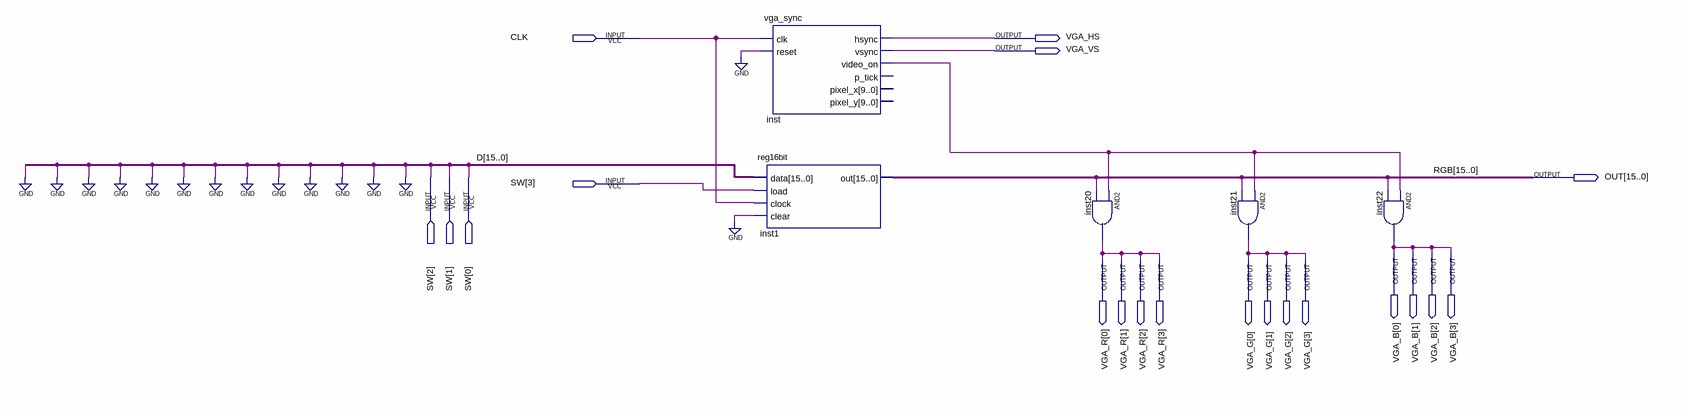
[diagram p0: schematic sheet]
// Quartus schematic VGA_TEST.bdf as structural Verilog: 5 symbols, 20 pins
module VGA_TEST (
  input  CLK,
  input  [3:0] SW,
  output VGA_HS,
  output VGA_VS,
  output [15:0] OUT,
  output [3:0] VGA_B,
  output [3:0] VGA_R,
  output [3:0] VGA_G
);

  wire inst_video_on;
  wire [3:3] D;

  vga_sync inst (
    .clk(CLK), .reset(1'b0), .hsync(VGA_HS), .vsync(VGA_VS), .video_on(inst_video_on));  // open: p_tick, pixel_x, pixel_y
  reg16bit inst1 (.data({{12{1'b0}}, D[3], SW[2:0]}), .load(SW[3]), .clock(CLK), .clear(1'b0), .out(OUT));
  and inst20 (VGA_R[3], inst_video_on, OUT[2]);
  and inst21 (VGA_G[3], inst_video_on, OUT[1]);
  and inst22 (VGA_B[3], inst_video_on, OUT[0]);

  assign VGA_B[2:0] = {3{VGA_B[3]}};
  assign VGA_G[2:0] = {3{VGA_G[3]}};
  assign VGA_R[2:0] = {3{VGA_R[3]}};

  // Other names for the same wires on the sheet: D[2:0] = SW[2:0]; RGB[15:0] = OUT
endmodule
